# Altium project sensor-module-stack.PrjPcb
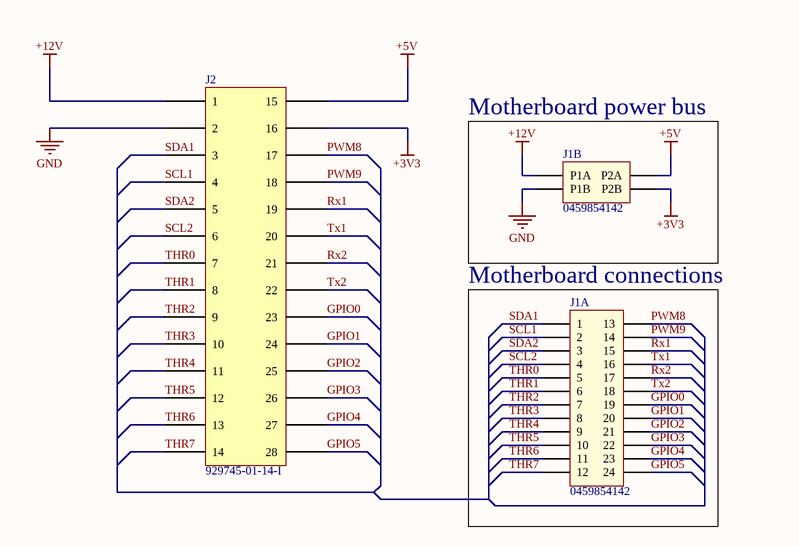
[diagram p0: BaseCard.SchDoc]
1 sheet, 2 parts. Net scope: global (net labels, ports and power ports of the same name join across sheets).
Board file: BaseCard.PcbDoc

## Sheet BaseCard.SchDoc
size A3; CompanyName: VORTEX NTNU

### Parts
J1  0459854142  [CONN_HEADER_4PWR_24SGL_2.36MM]  (parts A,B of 2)
J2  929745-01-14-I  [Header_14x2_RA]

### Blocks framed on the sheet
Motherboard power bus: J1
Motherboard connections: J1

### Nets
+3V3: J1.P2B J2.16
+5V: J1.P2A J2.15
+12V: J1.P1A J2.1
GND: J1.P1B J2.2
GPIO0: J1.19 J2.23
GPIO1: J1.20 J2.24
GPIO2: J1.21 J2.25
GPIO3: J1.22 J2.26
GPIO4: J1.23 J2.27
GPIO5: J1.24 J2.28
PWM8: J1.13 J2.17
PWM9: J1.14 J2.18
Rx1: J1.15 J2.19
Rx2: J1.17 J2.21
SCL1: J1.2 J2.4
SCL2: J1.4 J2.6
SDA1: J1.1 J2.3
SDA2: J1.3 J2.5
THR0: J1.5 J2.7
THR1: J1.6 J2.8
THR2: J1.7 J2.9
THR3: J1.8 J2.10
THR4: J1.9 J2.11
THR5: J1.10 J2.12
THR6: J1.11 J2.13
THR7: J1.12 J2.14
Tx1: J1.16 J2.20
Tx2: J1.18 J2.22

### Notes on the sheet
- Title
- Size
- Author
- Rev
- A3
- Sheet no.
- of

### Library data of the parts
J1 = 0459854142: Number Of Positions: 28; Part Number: 0459854142; ComponentLink1Description: Manufacturer Link; ComponentLink1URL: http://www.molex.com/; ComponentLink2Description: Datasheet; ComponentLink2URL: http://www.molex.com/pdm_docs/sd/459854111_sd.pdf; Supplier 1: Digi-Key; Supplier Part Number 1: WM8736-ND; Number Of Rows: 2; Mounting Type: Through Hole
J2 = 929745-01-14-I: Number Of Positions: 28; Part Number: 929745-01-14-I; ComponentLink1Description: Manufacturer Link; ComponentLink1URL: https://www.3m.com/3M/en_US/interconnect-us/; ComponentLink2Description: Datasheet; ComponentLink2URL: http://multimedia.3m.com/mws/media/43897O/3mtmpinstriphdr-100-100x-100-929-series-ts0769.pdf; Supplier 1: Digi-Key; Supplier Part Number 1: 3M156384-28-ND; Number Of Rows: 2; Mounting Type: Through Hole